# Altium project S.ANALOG-G5-5A.PrjPcb.PrjPcb
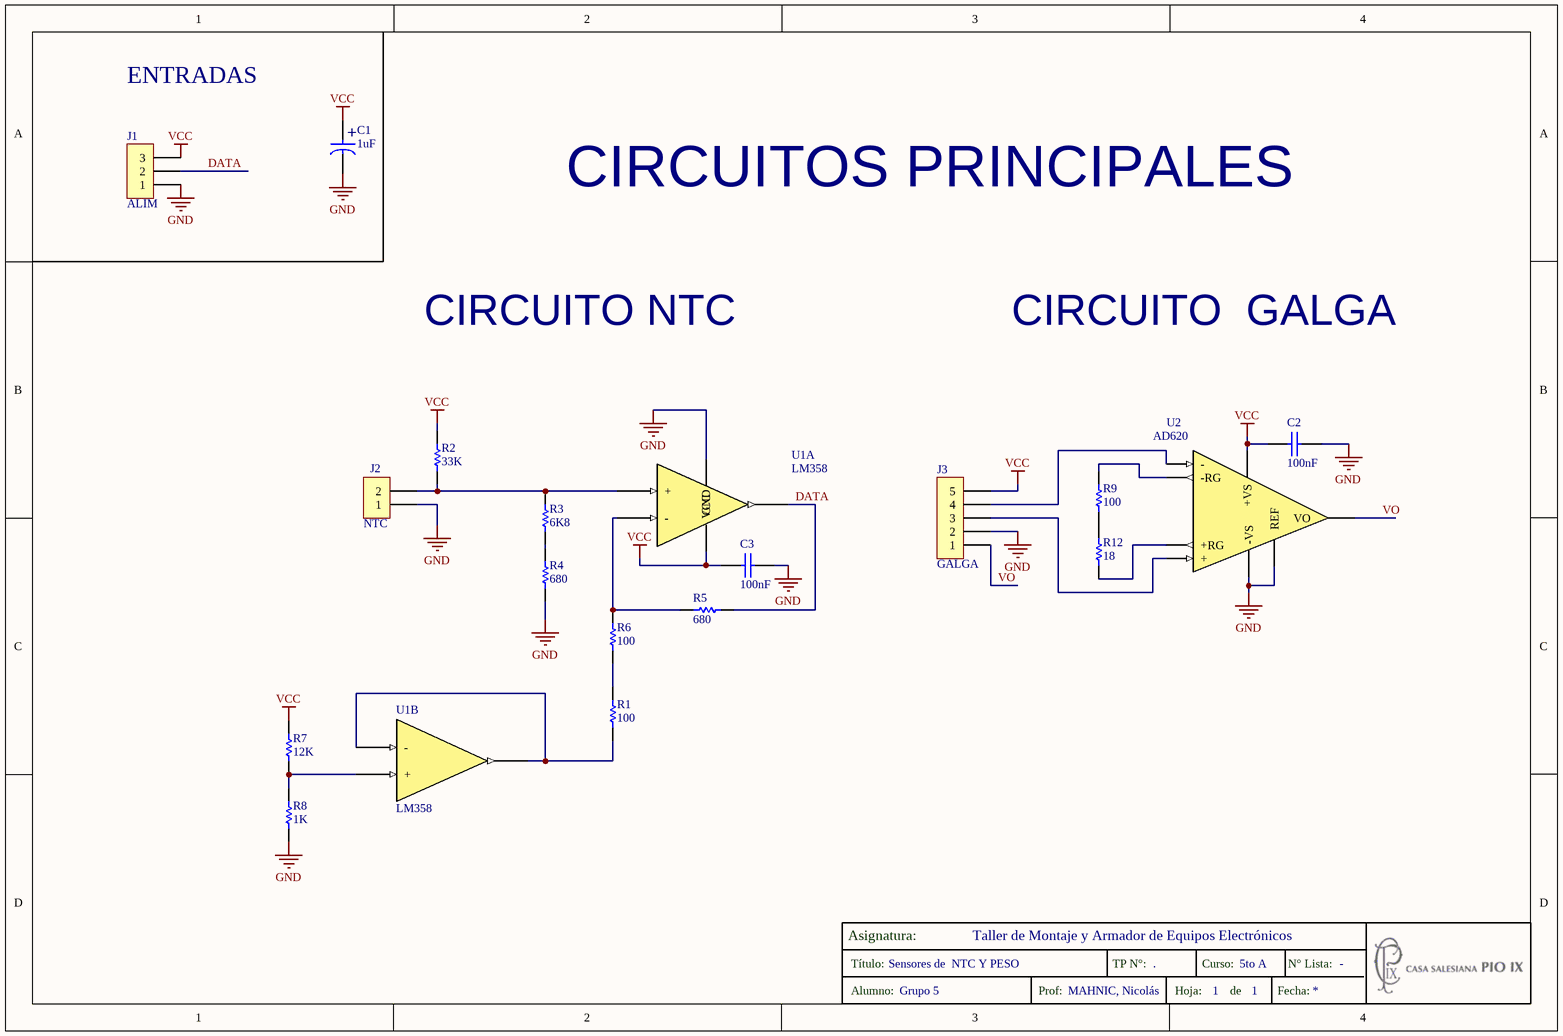
[diagram p0: S.ANALOG-G5-5A.schDoc.SchDoc]
1 sheet, 18 parts. Net scope: global (net labels, ports and power ports of the same name join across sheets).
Board file: S.ANALOG-G5-5A.pcbDoc.PcbDoc

## Sheet S.ANALOG-G5-5A.schDoc.SchDoc
size A4; SheetNumber: 1; SheetTotal: 1; Titulo: Sensores de  NTC Y PESO; Alumno: Grupo 5; profesor: MAHNIC, Nicolás; curso: 5to A; TPN: .; NLista: -; Asignatura: Taller de Montaje y Armador de Equipos Electrónicos; Año: 2019; Rule: PcbType=ProtelPcb

### Parts
C1  1uF  [Capol]
C2  100nF  [0805]
C3  100nF  [0805]
J1  ALIM  [SIP3]
J2  NTC  [BORNERA2]
J3  GALGA  [SIP5 90]
R1  100  [0805]
R2  33K  [0805]
R3  6K8  [0805]
R4  680  [0805]
R5  680  [0805]
R6  100  [0805]
R7  12K  [0805]
R8  1K  [0805]
R9  100  [0805]
R12  18  [0805]
U1  LM358  [LM358 SMD]  (parts A,B of 2)
U2  AD620  [DIP8]

### Nets
GND: C1.2 C2.2 C3.2 J1.1 J2.1 J3.2 R4.1 R8.1 U1.4(GND) U2.4(-VS) U2.5(REF)
VCC: C1.1 C2.1 C3.1 J1.3 J3.5 R2.2 R7.2 U1.8(VCC) U2.7(+VS)
DATA: J1.2 R5.1 U1.1(OUT_A)
VO: J3.1 U2.6(VO)
NetJ2_2: J2.2 R2.1 R3.2 U1.3(+)
NetJ3_3: J3.3 U2.3(+)
NetJ3_4: J3.4 U2.2(-)
NetR1_1: R1.1 R6.2
NetR1_2: R1.2 U1.6(-) U1.7(OUT_B)
NetR3_1: R3.1 R4.2
NetR5_2: R5.2 R6.1 U1.2(-)
NetR7_1: R7.1 R8.2 U1.5(+)
NetR9_1: R9.1 U2.1(-RG)
NetR9_2: R9.2 R12.1
NetR12_2: R12.2 U2.8(+RG)

### Notes on the sheet
- ENTRADAS
- CIRCUITOS PRINCIPALES
- CIRCUITO NTC
- CIRCUITO  GALGA
- Asignatura:
- Título:
- TP N°:
- Curso:
- N° Lista:
- Alumno:
- Prof:
- Hoja:
- de
- Fecha:
- (in symbol CAPPOL) +

### Library data of the parts
C1 = CAPPOL: Cap polarizado
C2 C3 = CAP: Autor: Guido Spataro; Data: Libebal; Fecha: 07/04/19
J1 = CON3
J2 = BORNERA 2
J3 = CON5
R1-R9 R12 = RES: Resistencia; Autor: Guido Spataro; Data: Libebal; Fecha: 07/04/19
U2 = AD623